# EAGLE schematic Honig Sensor Board_2_01 (EAGLE 9.6.1)
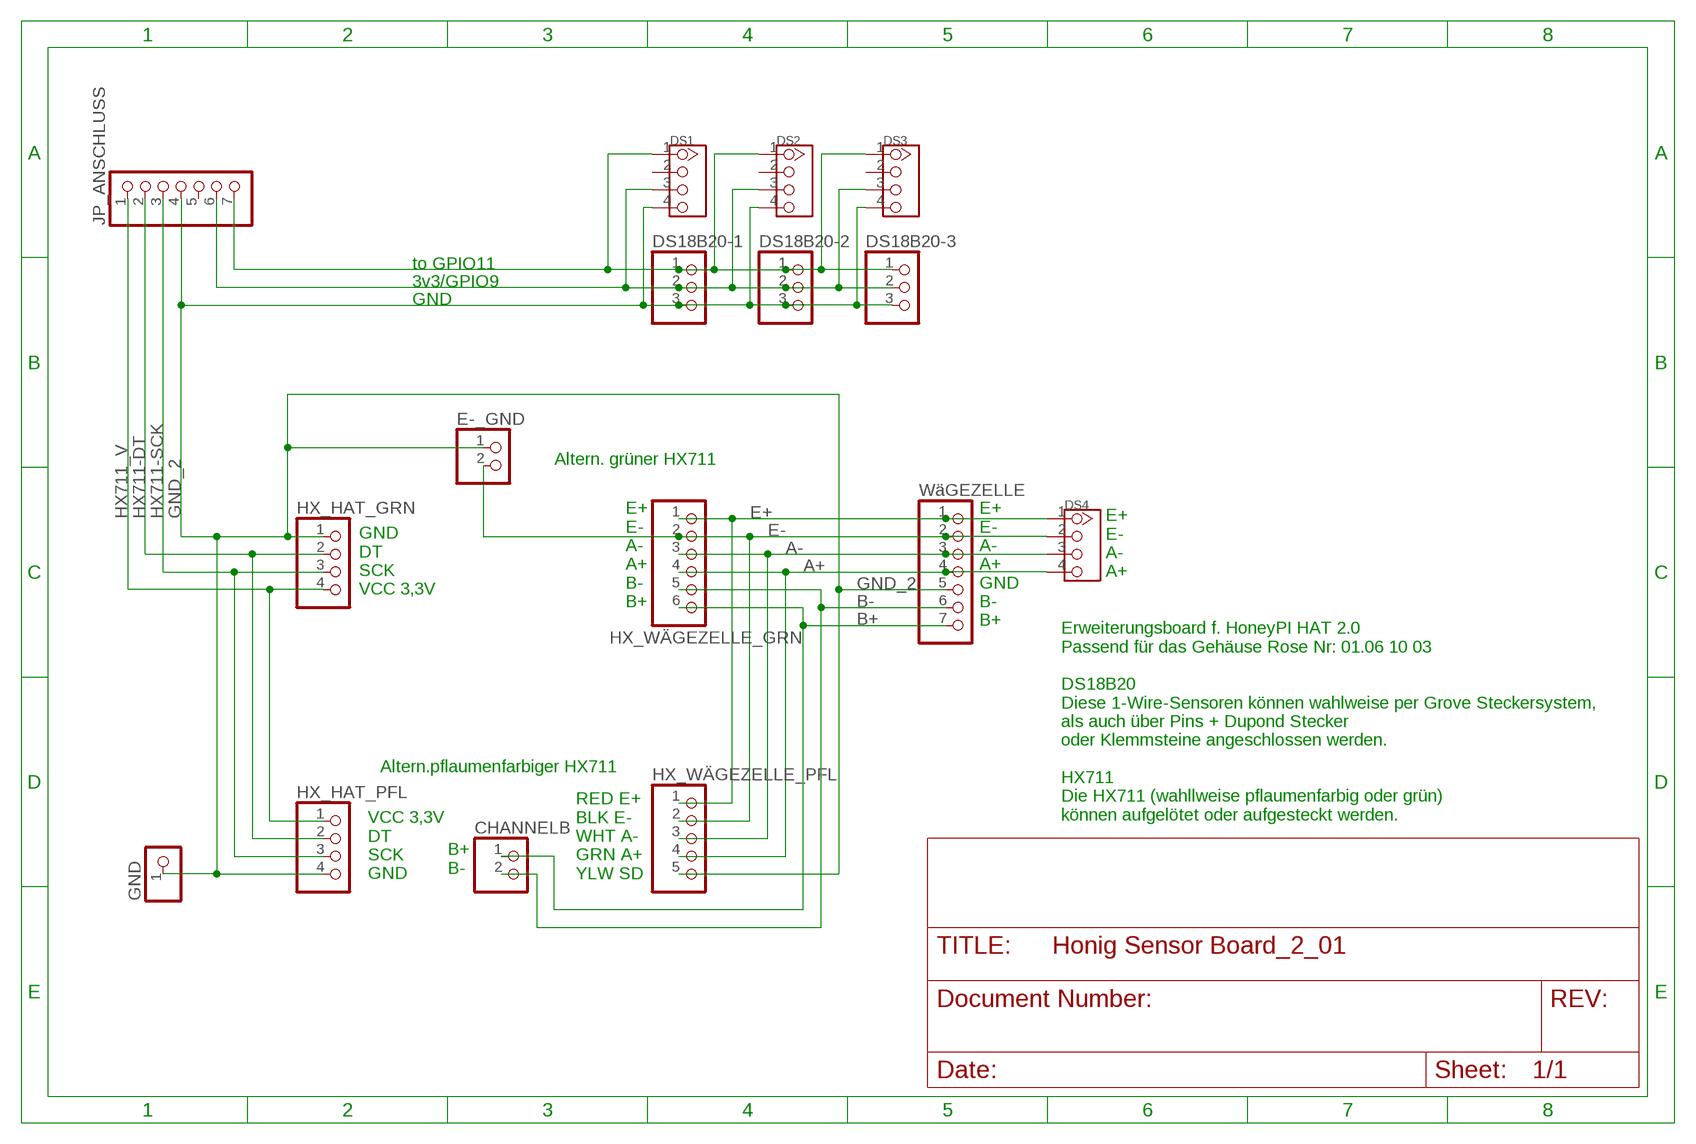
[diagram p0: schematic, sheet 1]

## Parts
CHANNELB  PINHD-1X2  [1X02]
DS1  TWIG-4P-2.0-2.0  [4P-2.0]
DS2  TWIG-4P-2.0-2.0  [4P-2.0]
DS3  TWIG-4P-2.0-2.0  [4P-2.0]
DS4  TWIG-4P-2.0-2.0  [4P-2.0]
DS18B20-1  PINHD-1X3  [1X03]
DS18B20-2  PINHD-1X3  [1X03]
DS18B20-3  PINHD-1X3  [1X03]
E-_GND  PINHD-1X2  [1X02]
GND  PINHD-1X1  [1X01]
HX_HAT_GRN  PINHD-1X4  [1X04]
HX_HAT_PFL  PINHD-1X4  [1X04]
HX_WÄGEZELLE_GRN  PINHD-1X6  [1X06]
HX_WÄGEZELLE_PFL  PINHD-1X5  [1X05]
JP_ANSCHLUSS  PINHD-1X7  [1X07]
WäGEZELLE  PINHD-1X7  [1X07]

## Nets
3V3 [Supply3v3]: DS1.3 DS2.3 DS3.3 DS18B20-1.2 DS18B20-2.2 DS18B20-3.2 JP_ANSCHLUSS.6
A+: DS4.4 HX_WÄGEZELLE_GRN.4 HX_WÄGEZELLE_PFL.4 WäGEZELLE.4
A-: DS4.3 HX_WÄGEZELLE_GRN.3 HX_WÄGEZELLE_PFL.3 WäGEZELLE.3
B+: CHANNELB.1 HX_WÄGEZELLE_GRN.6 WäGEZELLE.7
B-: CHANNELB.2 HX_WÄGEZELLE_GRN.5 WäGEZELLE.6
DS18B20_DATA_GPIO11_PIN23: DS1.1 DS2.1 DS3.1 DS18B20-1.1 DS18B20-2.1 DS18B20-3.1 JP_ANSCHLUSS.7
E+: DS4.1 HX_WÄGEZELLE_GRN.1 HX_WÄGEZELLE_PFL.1 WäGEZELLE.1
E-: DS4.2 E-_GND.2 HX_WÄGEZELLE_GRN.2 HX_WÄGEZELLE_PFL.2 WäGEZELLE.2
GND_2 [Supply3v3]: DS1.4 DS2.4 DS3.4 DS18B20-1.3 DS18B20-2.3 DS18B20-3.3 E-_GND.1 GND.1 HX_HAT_GRN.1 HX_HAT_PFL.4 HX_WÄGEZELLE_PFL.5 JP_ANSCHLUSS.4 WäGEZELLE.5
HX711-DT: HX_HAT_GRN.2 HX_HAT_PFL.2 JP_ANSCHLUSS.2
HX711-SCK: HX_HAT_GRN.3 HX_HAT_PFL.3 JP_ANSCHLUSS.3
HX711_V [Supply5v]: HX_HAT_GRN.4 HX_HAT_PFL.1 JP_ANSCHLUSS.1
Unconnected: DS1.2 DS2.2 DS3.2 JP_ANSCHLUSS.5

## Notes on the sheet
- to GPIO11
- 3v3/GPIO9
- GND
- Altern. grüner HX711
- GND
  DT
  SCK
  VCC 3,3V
- E+
  E-
  A-
  A+
  B-
  B+
- E+
  E-
  A-
  A+
- E+
  E-
  A-
  A+
  GND
  B-
  B+
- Altern.pflaumenfarbiger HX711
- Erweiterungsboard f. HoneyPI HAT 2.0
  Passend für das Gehäuse Rose Nr: 01.06 10 03 
  
  DS18B20
  Diese 1-Wire-Sensoren können wahlweise per Grove Steckersystem,
  als auch über Pins + Dupond Stecker
  oder Klemmsteine angeschlossen werden.
  
  HX711
  Die HX711 (wahllweise pflaumenfarbig oder grün)
  können aufgelötet oder aufgesteckt werden.
- B+
  B-
- VCC 3,3V
  DT
  SCK
  GND
- RED E+
  BLK E-
  WHT A-
  GRN A+
  YLW SD

## Library data of the parts
CHANNELB E-_GND = pinhead:PINHD-1X2: PIN HEADER
DS1-DS4 = Connector:TWIG-4P-2.0
DS18B20-1-DS18B20-3 = pinhead:PINHD-1X3: PIN HEADER
GND = pinhead:PINHD-1X1: PIN HEADER
HX_HAT_GRN HX_HAT_PFL = pinhead:PINHD-1X4: PIN HEADER
HX_WÄGEZELLE_GRN = pinhead:PINHD-1X6: PIN HEADER
HX_WÄGEZELLE_PFL = pinhead:PINHD-1X5: PIN HEADER
JP_ANSCHLUSS WäGEZELLE = pinhead:PINHD-1X7: PIN HEADER

## Net classes
0 Signal: width 0.152 mm, clearance 0.305 mm
1 Supply3v3: width 0.203 mm, clearance 0.305 mm
2 Supply5v: width 0.406 mm, clearance 0.305 mm